# EAGLE design Programmer (EAGLE 8.2.2)
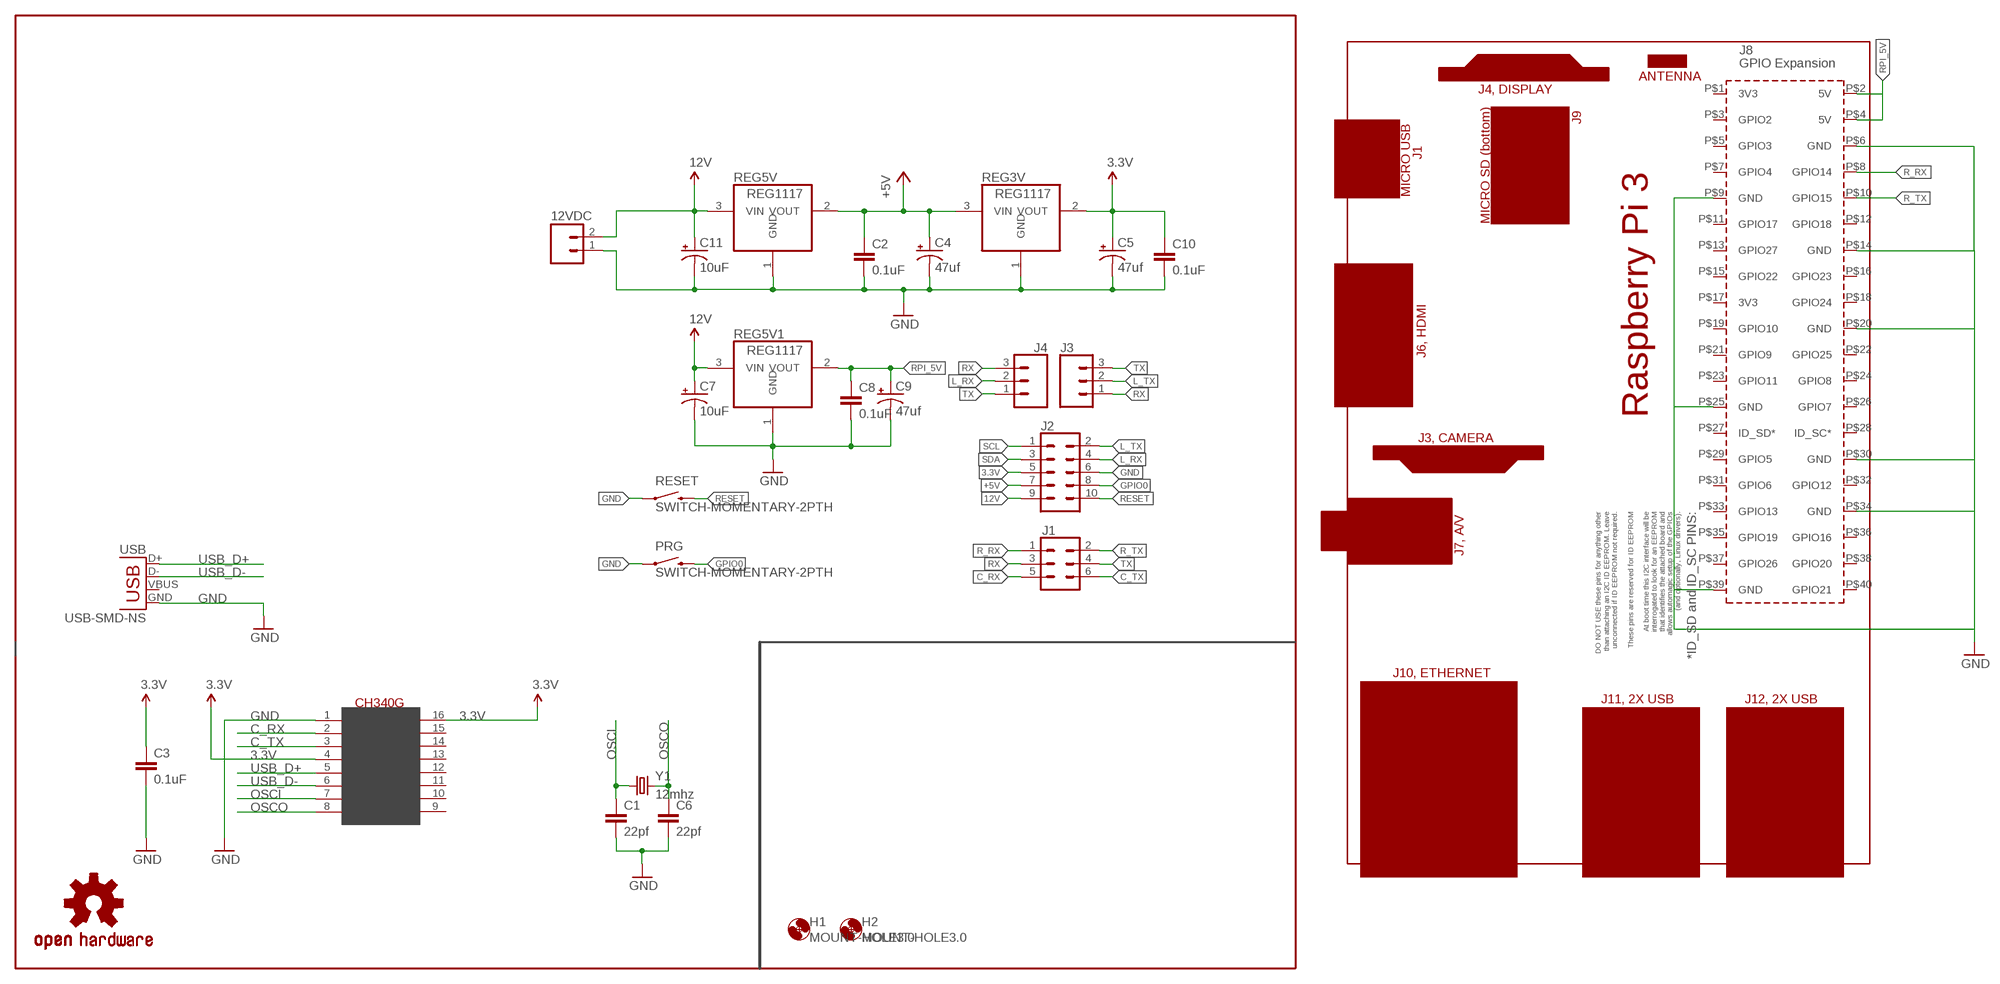
[diagram p0: schematic, sheet 1]

## Parts
12VDC  M023.5MM  [SCREWTERMINAL-3.5MM-2]
C1  22pf  CAP1206  [1206]
C2  0.1uF  0.1UF-25V(+80/-20%)(0603)  [0603-CAP]
C3  0.1uF  C-EUC1206K  [C1206K]
C4  47uf  CAP_POLC  [PANASONIC_C]
C5  47uf  CAP_POLC  [PANASONIC_C]
C6  22pf  CAP1206  [1206]
C7  10uF  10UF-TANT  [EIA3216]
C8  0.1uF  0.1UF-25V(+80/-20%)(0603)  [0603-CAP]
C9  47uf  CAP_POLC  [PANASONIC_C]
C10  0.1uF  0.1UF-25V(+80/-20%)(0603)  [0603-CAP]
C11  10uF  10UF-TANT  [EIA3216]
FRAME1  FRAME-LETTERNO_PACKAGE  [DUMMY]
H1  MOUNT-HOLE3.0  [3,0]
H2  MOUNT-HOLE3.0  [3,0]
J1  CONN_03X22X3_SILK_MALE_PTH  [2X3]
J2  CONN_05X2SHD  [2X5-SHROUDED]
J3  CONN_03LOCK  [1X03_LOCK]
J4  CONN_03LOCK  [1X03_LOCK]
LOGO2  OSHW-LOGOS  [OSHW-LOGO-S]
PCB1  RPI3  [RPI3]
PRG  SWITCH-MOMENTARY-2PTH  [TACTILE-PTH]
REG3V  REG1117  [SOT223]
REG5V  REG1117  [SOT223]
REG5V1  REG1117  [SOT223]
RESET  SWITCH-MOMENTARY-2PTH  [TACTILE-PTH]
U$2  CH340G  [SOIC16]
USB  USB-SMD-NS  [USB-MINIB-NOSTOP]
Y1  12mhz  CRYSTALSMD  [HC49UP]

## Nets
3.3V: C3.1 C5.+ C10.1 J2.5 REG3V.2(VOUT) U$2.4(V3) U$2.16(VCC)
12V: 12VDC.2 C7.A(+) C11.A(+) J2.9 REG5V1.3(VIN) REG5V.3(VIN)
+5V: C2.1 C4.+ J2.7 REG3V.3(VIN) REG5V.2(VOUT)
C_RX: J1.5 U$2.2(TX)
C_TX: J1.6 U$2.3(RX)
GND: 12VDC.1 C1.2 C2.2 C3.2 C4.- C5.- C6.2 C7.C(-) C8.2 C9.- C10.2 C11.C(-) J2.6 PCB1.P$6(GND) PCB1.P$9(GND) PCB1.P$14(GND) PCB1.P$20(GND) PCB1.P$25(GND) PCB1.P$30(GND) PCB1.P$34(GND) PCB1.P$39(GND) PRG.1 REG3V.1(GND) REG5V1.1(GND) REG5V.1(GND) RESET.1 U$2.1(GND) USB.GND
GPIO0: J2.8 PRG.3
L_RX: J2.4 J4.2
L_TX: J2.2 J3.2
OSCI: C1.1 U$2.7(XI) Y1.1
OSCO: C6.1 U$2.8(XO) Y1.2
R_RX: J1.1 PCB1.P$8(GPIO14)
R_TX: J1.2 PCB1.P$10(GPIO15)
RESET: J2.10 RESET.3
RPI_5V: C8.1 C9.+ PCB1.P$2(5V) PCB1.P$4(5V) REG5V1.2(VOUT)
RX: J1.3 J3.1 J4.3
SCL: J2.1
SDA: J2.3
TX: J1.4 J3.3 J4.1
USB_D+: U$2.5(D+) USB.D+
USB_D-: U$2.6(D-) USB.D-
Unconnected: PCB1.P$1(3V3) PCB1.P$3(GPIO2) PCB1.P$5(GPIO3) PCB1.P$7(GPIO4) PCB1.P$11(GPIO17) PCB1.P$12(GPIO18) PCB1.P$13(GPIO27) PCB1.P$15(GPIO22) PCB1.P$16(GPIO23) PCB1.P$17(3V3) PCB1.P$18(GPIO24) PCB1.P$19(GPIO10) PCB1.P$21(GPIO9) PCB1.P$22(GPIO25) PCB1.P$23(GPIO11) PCB1.P$24(GPIO8) PCB1.P$26(GPIO7) PCB1.P$27(ID_SD*) PCB1.P$28(ID_SC*) PCB1.P$29(GPIO5) PCB1.P$31(GPIO6) PCB1.P$32(GPIO12) PCB1.P$33(GPIO13) PCB1.P$35(GPIO19) PCB1.P$36(GPIO16) PCB1.P$37(GPIO26) PCB1.P$38(GPIO20) PCB1.P$40(GPIO21) U$2.9(CTS) U$2.10(DSR) U$2.11(RI) U$2.12(DCD) U$2.13(DTR) U$2.14(RTS) U$2.15(RS232) USB.VBUS

## Library data of the parts
12VDC = SparkFun-Connectors:M02: Standard 2-pin 0.1" header. Use with - straight break away headers ( PRT-00116) - right angle break away headers (PRT-00553) - swiss pins (PRT-00743) - machine pins (PRT-00117) - female headers (PRT-00115) Molex polarized connector foot print use with: PRT-08233 with associated crimp pins and housings. 2.54_SCREWTERM for use with PRT-10571. 3.5mm Screw Terminal footprints for PRT-08084 5mm Screw Terminal footprints for use with PRT-08432; PROD_ID: CONN-08399
C1 C6 = SparkFun-Capacitors:CAP: Capacitor Standard 0603 ceramic capacitor, and 0.1" leaded capacitor.
C2 C8 C10 = SparkFun-Capacitors:0.1UF-25V(+80/-20%)(0603): CAP-00810 Ceramic Standard decoupling cap; PROD_ID: CAP-00810
C3 = rcl:C-EU: CAPACITOR, European symbol
C4 C5 C9 = SparkFun-Capacitors:CAP_POL: Capacitor Polarized These are standard SMD and PTH capacitors. Normally 10uF, 47uF, and 100uF in electrolytic and tantalum varieties. Always verify the external diameter of the through hole cap, it varies with capacity, voltage, and manufacturer. The EIA devices should be standard.
C7 C11 = SparkFun-Retired:10UF-TANT: 10uF Tantalum SMT CAP-00811- 16V 10% (EIA-3216); PROD_ID: CAP-00811
FRAME1 = SparkFun-Aesthetics:FRAME-LETTER: Schematic Frame Standard 8.5x11 US Letter frame; DESIGNER: Nobody; VERSION: v01
H1 H2 = holes:MOUNT-HOLE: MOUNTING HOLE with drill center marker
J1 = SparkFun-Connectors:CONN_03X2: Multi connection point. Often used as Generic Header-pin footprint for 0.1 inch spaced/style header connections You can populate with any combo of single row headers, but if you'd like an exact match, check these: Header - 2x3 (Male, 0.1") <https://www.sparkfun.com/products/12807> (PRT-12807) Header - 2x3 (Female, 0.1") <https://www.sparkfun.com/products/13010> (PRT-13010) 2x3 Pin Shrouded Header <https://www.sparkfun.com/products/10877> (PRT-10877) On any of the 0.1 inch spaced packages, you can populate with these: Break Away Headers - Straight <https://www.sparkfun.com/products/116> (PRT-00116) Break Away Male Headers - Right Angle <https://www.sparkfun.com/products/553> (PRT-00553) Female Headers <https://www.sparkfun.com/products/115> (PRT-00115) Break Away Headers - Machine Pin <https://www.sparkfun.com/products/117> (PRT-00117) Break Away Female Headers - Swiss Machine Pin <https://www.sparkfun.com/products/743> (PRT-00743) Special note: the shrouded connector mates well with our 3x2 ribbon cables: Ribbon Crimp Connector - 6-pin (2x3, Female) <https://www.sparkfun.com/products/10651> (PRT-10651) Ribbon Cable - 6 wire (15ft) <https://www.sparkfun.com/products/10646> (PRT-10646); PROD_ID: CONN-09701
J2 = SparkFun-Connectors:CONN_05X2: Multi connection point. Often used as Generic Header-pin footprint for 0.1 inch spaced/style header connections For AVR SPI programming port, see special device with nice symbol: "AVR_SPI_PROG_5x2.dev" You can populate with any combo of single row headers, but if you'd like an exact match, check these: 2x5 AVR ICSP Male Header <https://www.sparkfun.com/products/778> (PRT-00778) 2x5 Pin Shrouded Header <https://www.sparkfun.com/products/8506> (PRT-08506) On any of the 0.1 inch spaced packages, you can populate with these: Break Away Headers - Straight <https://www.sparkfun.com/products/116> (PRT-00116) Break Away Male Headers - Right Angle <https://www.sparkfun.com/products/553> (PRT-00553) Female Headers <https://www.sparkfun.com/products/115> (PRT-00115) Break Away Headers - Machine Pin <https://www.sparkfun.com/products/117> (PRT-00117) Break Away Female Headers - Swiss Machine Pin <https://www.sparkfun.com/products/743> (PRT-00743) Special note: the shrouded connector mates well with our 5x2 ribbon cables: 2x5 Pin IDC Ribbon Cable <https://www.sparkfun.com/products/8535> (PRT-08535); PROD_ID: CONN-08671; SF_ID: PRT-08506
J3 J4 = SparkFun-Connectors:CONN_03: Multi connection point. Often used as Generic Header-pin footprint for 0.1 inch spaced/style header connections On any of the 0.1 inch spaced packages, you can populate with these: Break Away Headers - Straight <https://www.sparkfun.com/products/116> (PRT-00116) Break Away Male Headers - Right Angle <https://www.sparkfun.com/products/553> (PRT-00553) Female Headers <https://www.sparkfun.com/products/115> (PRT-00115) Break Away Headers - Machine Pin <https://www.sparkfun.com/products/117> (PRT-00117) Break Away Female Headers - Swiss Machine Pin <https://www.sparkfun.com/products/743> (PRT-00743) Stackable Header - 3 Pin (Female, 0.1") <https://www.sparkfun.com/products/13875> (PRT-13875) For SCREWTERMINALS and SPRING TERMINALS visit here: Screw Terimnals on SparkFun.com <https://www.sparkfun.com/search/results?term=Screw+Terminals> (5mm/3.5mm/2.54mm spacing) This device is also useful as a general connection point to wire up your design to another part of your project. Our various solder wires solder well into these plated through hole pads. Hook-Up Wire - Assortment (Stranded, 22 AWG) <https://www.sparkfun.com/products/11375> (PRT-11375) Hook-Up Wire - Assortment (Solid Core, 22 AWG) <https://www.sparkfun.com/products/11367> (PRT-11367) View the entire wire category on our website here <https://www.sparkfun.com/categories/141> Special notes: Molex polarized connector foot print use with SKU : PRT-08232 with associated crimp pins and housings.
LOGO2 = SparkFun-Aesthetics:OSHW-LOGO: Open Source Hardware Logo This logo indicates the piece of hardware it is found on incorporates a OSHW license and/or adheres to the definition of open source hardware found here: http://freedomdefined.org/OSHW
PCB1 = e14_Rpi3_RevA:RPI3: Device for Raspberry Pi 3 board created by Dave Young for www.element14.com More information and support community is available at https://www.element14.com/community/community/raspberry-pi
PRG RESET = SparkFun-Electromechanical:SWITCH-MOMENTARY-2: Various NO switches- pushbuttons, reed, etc
REG3V REG5V REG5V1 = burr-brown:REG1117: 800mA and 1A Low Dropout (LDO) Positive Regulator 1.8V, 2.5V, 2.85V, 3.3V, 5V, and Adj; MPN: REG1117; OC_FARNELL: 1097566; OC_NEWARK: 14P6981
U$2 = CH340G-USB-SERIAL:CH340G
USB = SparkFun-Connectors:USB: USB Connectors USB-B-PTH is fully proven SKU : PRT-00139/CONN-08278 USB-miniB is fully proven SKU : PRT-00587 USB-A-PCB is untested. USB-A-H is throughly reviewed, but untested. Spark Fun Electronics SKU : PRT-00437 USB-B-SMT is throughly reviewed, but untested. Needs silkscreen touching up. USB-A-S has not been used/tested USB-MB-H has not been used/tested USB-MICROB has been used. CONN-09505
Y1 = SparkFun-FreqCtrl:CRYSTAL: Various standard crystals. Proven footprints.

## Board
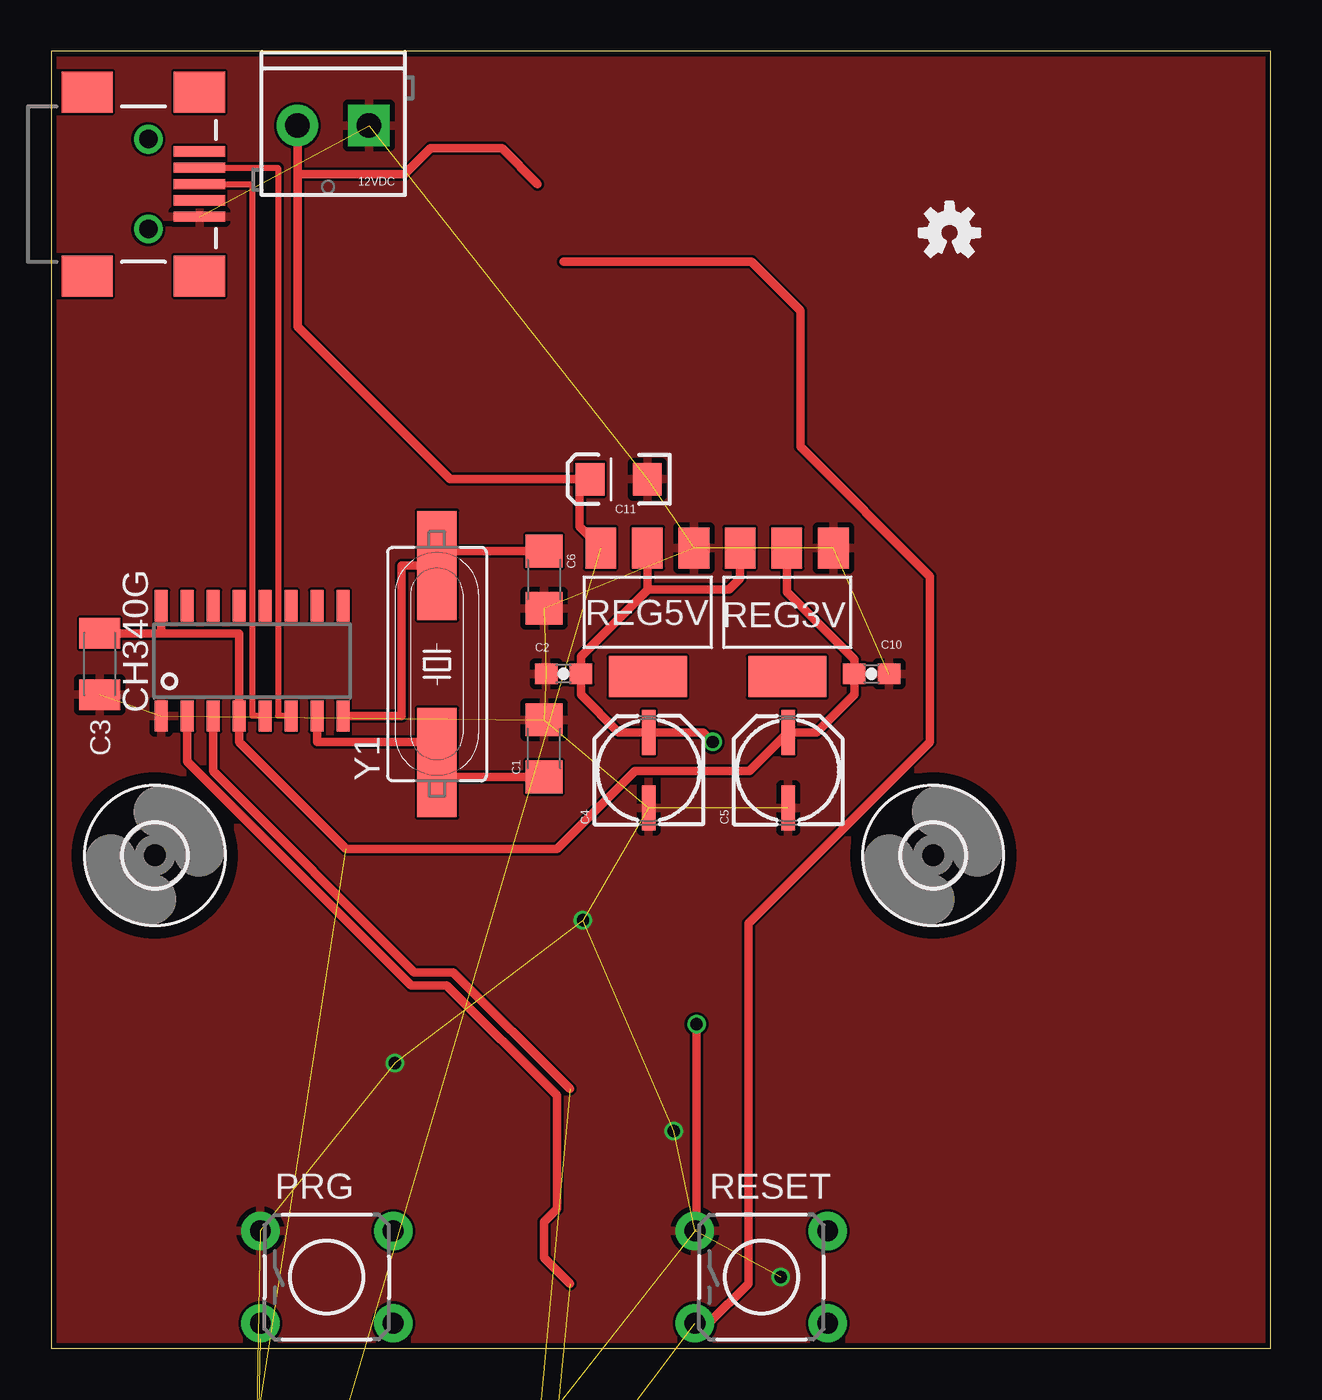
[diagram p1: board, top side]
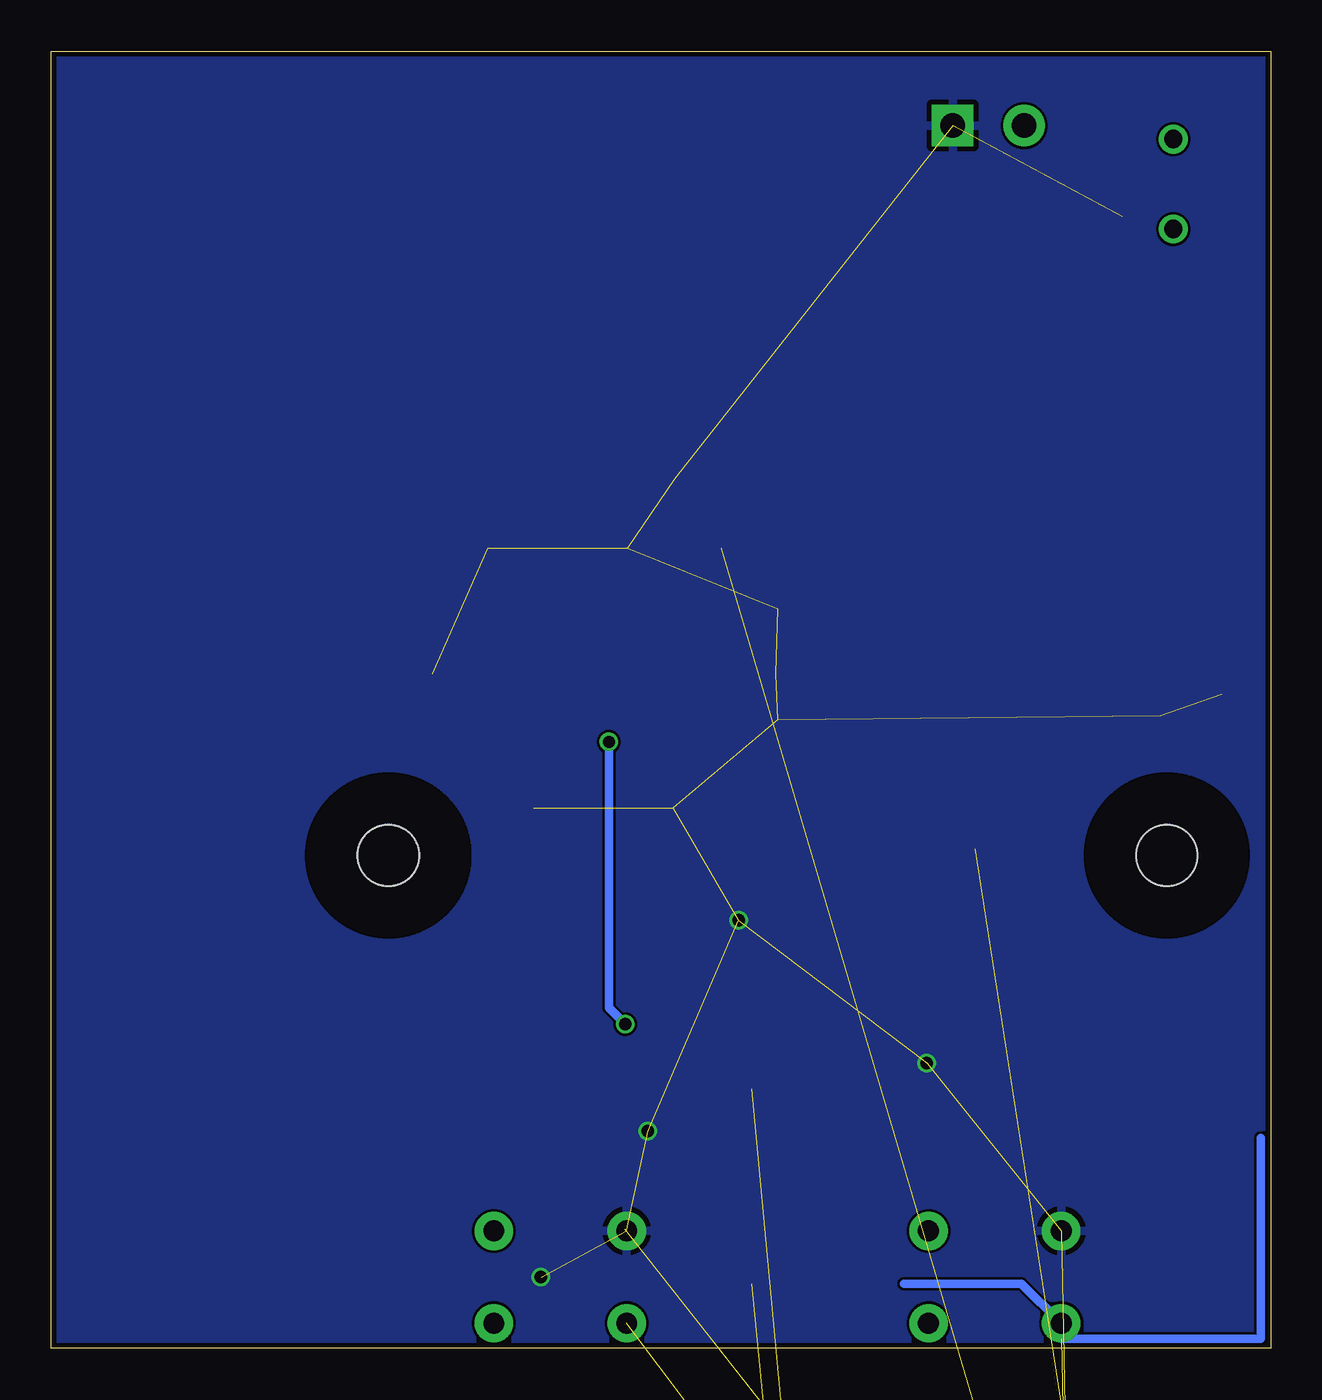
[diagram p2: board, bottom side, seen from below]

Size 59.69 x 63.5 mm. Coordinates in mm from the lower left corner, seen from the top.
Outline: 59.69,0 59.69,63.5 0,63.5 0,0 59.69,0
Copper layers (1*16): Top 0.035mm / dielectric 1.5mm / Bottom 0.035mm
Design rules "dirtypcbs": minimum track width 5mil, minimum drill 12mil, track to track 5mil, track to pad 5mil, pad to pad 5mil, via to via 5mil, smd to smd 0mil, copper to edge 10mil, drill to drill 10mil, minimum pad ring 10mil, minimum via ring 6mil, stop-mask expansion 2mil, vias tented up to drill 25mil, thermal gap 10mil

### Footprints (pad centres in the part's own frame; a part is rotated, then mirrored left to right if it is on the bottom)
SCREWTERMINAL-3.5MM-2 = drill 1.2 pad 2.032 square: 1 0,0 | drill 1.2 pad 2.032: 2 3.5,0
1206 = smd 1.6 x 1.8: 1 -1.4,0; 2 1.4,0
0603-CAP = smd 1.1 x 1: 1 -0.85,0; 2 0.85,0
C1206K = smd 1.5 x 2: 1 -1.5,0; 2 1.5,0
PANASONIC_C = smd 2.2 x 0.65: + 1.9,-0.2; - -1.8,-0.2
EIA3216 = smd 1.4 x 1.6: A 1.4,0; C -1.4,0
3,0 = hole 3: 0,0
2X3 = drill 1.016 pad 1.88: 1 0,0; 2 0,2.54; 3 2.54,0; 4 2.54,2.54; 5 5.08,0; 6 5.08,2.54
2X5-SHROUDED = drill 1.016 pad 1.88: 1 -1.27,5.08; 2 1.27,5.08; 3 -1.27,2.54; 4 1.27,2.54; 5 -1.27,0; 6 1.27,0; 7 -1.27,-2.54; 8 1.27,-2.54; 9 -1.27,-5.08; 10 1.27,-5.08
1X03_LOCK = drill 1.016 pad 1.88: 1 0,0.127; 2 2.54,-0.127; 3 5.08,0.127
RPI3 = drill 1.016 square: P$1 8.37,51.23 | drill 1.016: P$2 8.357,53.772; P$3 10.897,51.232; P$4 10.897,53.772; P$5 13.437,51.232; P$6 13.437,53.772; P$7 15.977,51.232; P$8 15.977,53.772; P$9 18.517,51.232; P$10 18.517,53.772; P$11 21.057,51.232; P$12 21.057,53.772; P$13 23.597,51.232; P$14 23.597,53.772; P$15 26.137,51.232; P$16 26.137,53.772; P$17 28.677,51.232; P$18 28.677,53.772; P$19 31.217,51.232; P$20 31.217,53.772; P$21 33.757,51.232; P$22 33.757,53.772; P$23 36.297,51.232; P$24 36.297,53.772; P$25 38.837,51.232; P$26 38.837,53.772; P$27 41.377,51.232; P$28 41.377,53.772; P$29 43.917,51.232; P$30 43.917,53.772; P$31 46.457,51.232; P$32 46.457,53.772; P$33 48.997,51.232; P$34 48.997,53.772; P$35 51.537,51.232; P$36 51.537,53.772; P$37 54.077,51.232; P$38 54.077,53.772; P$39 56.617,51.232; P$40 56.617,53.772 | hole 2.75: 3.5,3.5; 61.5,3.5; 3.5,52.5; 61.5,52.5
TACTILE-PTH = drill 1.016 pad 1.88: 1 -3.251,2.261; 2 3.251,2.261; 3 -3.251,-2.261; 4 3.251,-2.261
SOT223 = smd 1.499 x 2.007: 1 -2.261,-3.15; 2 0.025,-3.15; 3 2.311,-3.15 | smd 3.81 x 2.007: 4 0,3.15
SOIC16 = smd 0.635 x 1.524: 1 -4.445,-2.695; 2 -3.175,-2.695; 3 -1.905,-2.695; 4 -0.635,-2.695; 5 0.635,-2.695; 6 1.905,-2.695; 7 3.175,-2.695; 8 4.445,-2.695; 9 4.445,2.695; 10 3.175,2.695; 11 1.905,2.695; 12 0.635,2.695; 13 -0.635,2.695; 14 -1.905,2.695; 15 -3.175,2.695; 16 -4.445,2.695
USB-MINIB-NOSTOP = smd 2.5 x 0.5: D+ 2.5,0; D- 2.5,0.8; GND 2.5,-1.6; ID 2.5,-0.8; VBUS 2.5,1.6 | smd 2.5 x 2: G1 -3,-4.5; G2 -3,4.5; G3 2.5,4.5; G4 2.5,-4.5 | drill 0.9 pad 0.8: H1 0,2.2 | drill 0.9 pad 0.787: H2 0,-2.2
HC49UP = smd 5.334 x 1.93: 1 -4.826,0; 2 4.826,0

### Placement (x,y rotation side)
12VDC  15.56,59.85 180 top
C1  24.13,29.37 90 top
C2  25.08,33.02 180 top
C3  2.38,33.5 270 top
C4  29.05,28.26 90 top
C5  35.88,28.26 90 top
C6  24.13,37.62 270 top
C7  -0.16,-116.52 0 top  (outside the outline)
C8  -0.48,-120.65 0 top  (outside the outline)
C9  1.91,-125.57 0 top  (outside the outline)
C10  40.16,33.02 0 top
C11  27.78,42.55 180 top
FRAME1  0.16,0.48 0 top
H1  43.18,24.13 0 top
H2  5.08,24.13 0 top
J1  6.19,-141.6 0 top  (outside the outline)
J2  8.41,-22.7 0 top  (outside the outline)
J3  6.19,-160.66 0 top  (outside the outline)
J4  6.19,-179.71 0 top  (outside the outline)
LOGO2  43.97,54.61 0 top
PCB1  -2.22,-98.58 0 top  (outside the outline)
PRG  13.49,3.49 0 top
REG3V  36.04,36.04 180 top
REG5V  29.21,36.04 180 top
REG5V1  3.17,-107.31 0 top  (outside the outline)
RESET  34.77,3.49 0 top
U$2  9.84,33.66 0 top
USB  4.76,56.99 0 top
Y1  18.89,33.5 90 top

### Tracks (layer width: path | path; a pad name or v marks a point on that pad's centre or on a via)
3.3V  (1 unrouted)
  Top 0.406: REG3V.2 36.01,37.01 39.31,33.71 C10.1 39.31,32.01 37.46,30.16 C5.+ 34.18,28.26 28.57,28.26 24.77,24.45 14.45,24.45 9.21,29.69 U$2.4 9.21,35 5.4,35 | U$2.16 5.4,35 | 5.4,35 C3.1
12V  (3 unrouted)
  Top 0.406: 12VDC.2 12.06,57.94 | 12.06,57.94 12.06,57.47 17.3,57.47 18.57,58.74 22.07,58.74 23.81,56.99 | REG5V.3 25.87,40.22 25.87,42.23 26.06,42.23 C11.A 19.53,42.55 12.06,50.01 12.06,57.94
+5V  (via drill 0.6)  (1 unrouted)
  Top 0.406: REG3V.3 33.73,37.69 33.18,37.15 29.21,37.15 29.18,37.17 REG5V.2 29.18,37.12 25.93,33.87 C2.1 25.93,32.01 27.79,30.16 C4.+ 31.91,30.16 v32.38,29.69 | v31.59,15.88 31.59,5.83
  Bottom 0.406: v32.38,29.69 32.38,16.67 v31.59,15.88
C_RX  (1 unrouted)
  Top 0.406: U$2.2 6.67,28.73 17.62,17.78 19.37,17.78 24.77,12.38 24.77,6.83 24.13,6.19 24.13,4.45 25.4,3.17
C_TX  (1 unrouted)
  Top 0.406: U$2.3 7.94,28.26 17.78,18.41 19.68,18.41 25.4,12.7
GND  (via drill 0.6)  (31 unrouted)
  other vias: 26.04,20.95 16.83,13.97 30.48,10.64 35.72,3.49
  pour Top: 0,63.5 0,0 59.69,0 59.69,63.5
  pour Bottom: 59.69,0 59.69,63.5 0,63.5 0,0
GPIO0  (1 unrouted)
  Bottom 0.406: 0.48,10.3 0.48,0.48 10.24,0.48 PRG.3 12.19,3.17 17.94,3.17
L_RX  (1 unrouted)
L_TX  (1 unrouted)
OSCI
  Top 0.406: C1.1 18.89,27.97 Y1.1 18.89,29.69 13.02,29.69 U$2.7
OSCO
  Top 0.406: C6.1 18.89,39.02 Y1.2 17.14,38.32 17.14,30.96 U$2.8
R_RX  (1 unrouted)
R_TX  (1 unrouted)
RESET  (1 unrouted)
  Top 0.406: RESET.3 32.19,1.23 34.13,3.17 34.13,20.8 43.02,29.69 43.02,37.78 36.67,44.13 36.67,50.8 34.29,53.18 25.08,53.18
RPI_5V  (4 unrouted)
RX  (2 unrouted)
TX  (2 unrouted)
USB_D+
  Top 0.305: U$2.5 9.84,30.96 9.84,56.99 USB.D+
USB_D-
  Top 0.305: U$2.6 11.11,30.96 11.11,57.79 USB.D-